# EAGLE design ISPBreakout (EAGLE 6.4)
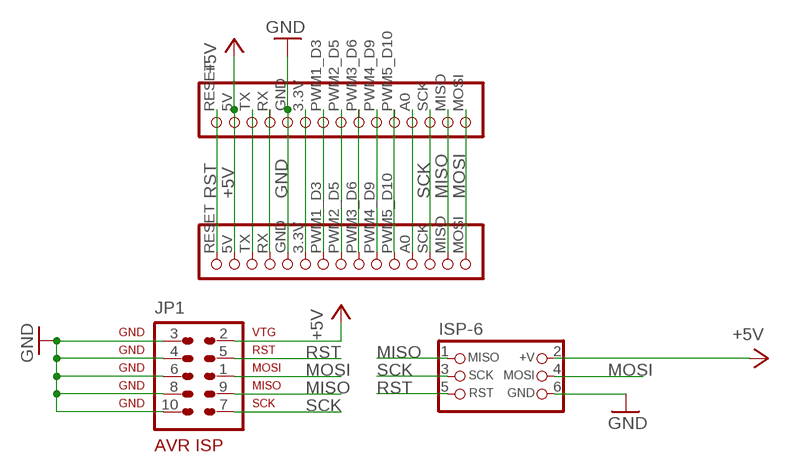
[diagram p0: schematic, sheet 1]

## Parts
ISP-6  ISP 6  CON_HEADER_PRG_AVR_ICSP-PTH  [HEADER_PRG_2X03]
JP1  ISP-10  AVR-ISP-10  [AVR-ISP-10]
U$1  RF1_HEADER_LEFT  [RF1_LEFTHEADER_ONLY]
U$2  RF1_HEADER_LEFT  [RF1_LEFTHEADER_ONLY]

## Nets
+5V: ISP-6.2(+V) JP1.2 U$1.5V U$2.5V
GND: ISP-6.6(GND) JP1.3 JP1.4 JP1.6 JP1.8 JP1.10 U$1.GND U$2.GND
MISO: ISP-6.1(MISO) JP1.9 U$1.MISO U$2.MISO
MOSI: ISP-6.4(MOSI) JP1.1 U$1.MOSI U$2.MOSI
N$1: U$1.TX U$2.TX
N$2: U$1.RX U$2.RX
N$3: U$1.3.3V U$2.3.3V
N$4: U$1.PWM1_D3(PWM1) U$2.PWM1_D3(PWM1)
N$5: U$1.PWM2_D5(PWM2) U$2.PWM2_D5(PWM2)
N$6: U$1.PWM3_D6(PWM3) U$2.PWM3_D6(PWM3)
N$7: U$1.PWM4_D9(PWM4) U$2.PWM4_D9(PWM4)
N$8: U$1.PWM5_D10(PWM5) U$2.PWM5_D10(PWM5)
N$9: U$1.A0(PC0) U$2.A0(PC0)
RST: ISP-6.5(RST) JP1.5 U$1.RESET U$2.RESET
SCK: ISP-6.3(SCK) JP1.7 U$1.SCK U$2.SCK

## Library data of the parts
ISP-6 = kombytax:CON_HEADER_PRG_AVR_ICSP: 2x3 AVR ICSP programming header
JP1 = avr-7:AVR-ISP-10: AVR ISP-10 Serial Programming Header
U$1 U$2 = komby1:RF1_HEADER_LEFT

## Board
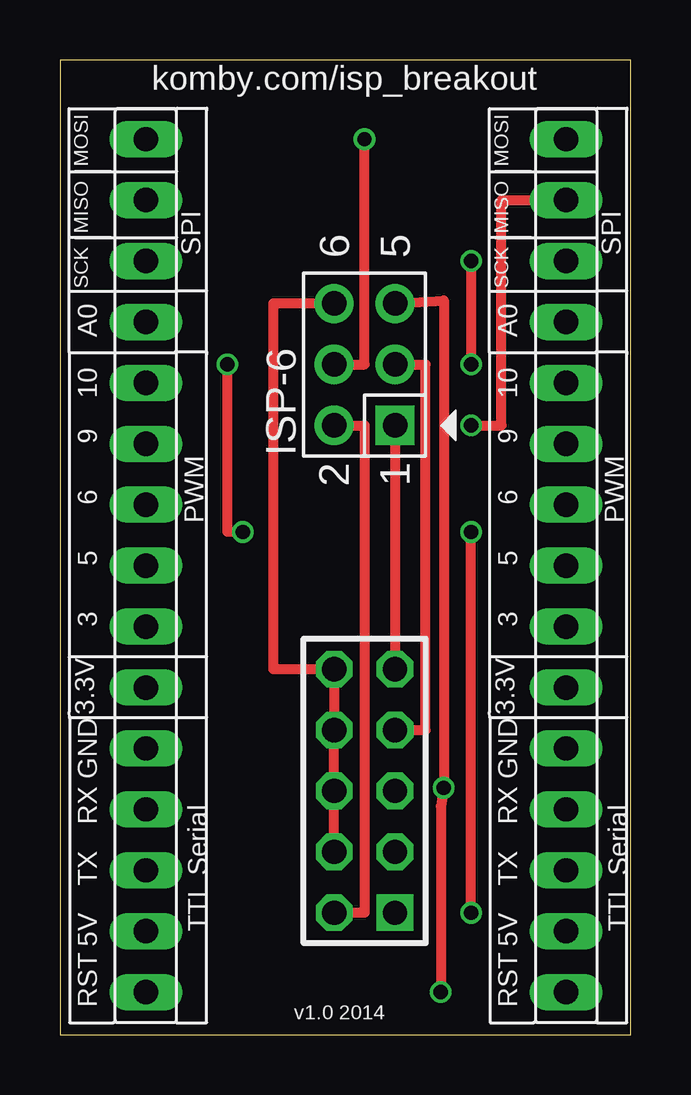
[diagram p1: board, top side]
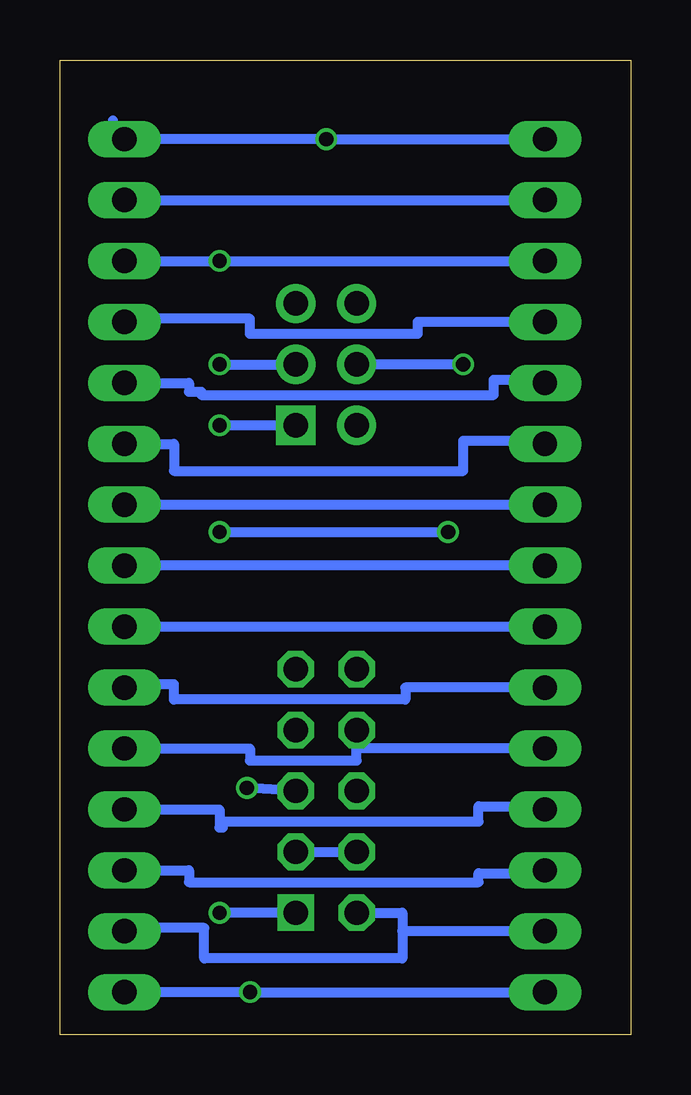
[diagram p2: board, bottom side, seen from below]

Size 23.8 x 40.63 mm. Coordinates in mm from the lower left corner, seen from the top.
Outline: 0,0 23.8,0 23.8,40.63 0,40.63 0,0
Copper layers (1*16): Top 0.035mm / dielectric 1.5mm / Bottom 0.035mm
Design rules "Fusion_eagle_rule_v1.1": minimum track width 6mil, minimum drill 12mil, track to track 6mil, track to pad 6mil, pad to pad 6mil, via to via 6mil, smd to smd 0mil, copper to edge 10mil, drill to drill 10mil, minimum pad ring 10mil, minimum via ring 6mil, stop-mask expansion 2mil, vias tented up to drill 100mil, thermal gap 10mil

### Footprints (pad centres in the part's own frame; a part is rotated, then mirrored left to right if it is on the bottom)
HEADER_PRG_2X03 = drill 1.02 pad 1.632 square: 1 -2.54,-1.27 | drill 1.02 pad 1.632: 2 -2.54,1.27; 3 0,-1.27; 4 0,1.27; 5 2.54,-1.27; 6 2.54,1.27
AVR-ISP-10 = drill 1.016 square: 1 -5.08,-1.27 | drill 1.016 octagon: 2 -5.08,1.27; 3 -2.54,-1.27; 4 -2.54,1.27; 5 0,-1.27; 6 0,1.27; 7 2.54,-1.27; 8 2.54,1.27; 9 5.08,-1.27; 10 5.08,1.27
RF1_LEFTHEADER_ONLY = drill 1.016 long: 3.3V 1.42,-5.215; 5V 1.42,-15.375; A0 1.42,10.025; GND 1.42,-7.755; MISO 1.42,15.105; MOSI 1.42,17.645; PWM1_D3 1.42,-2.675; PWM2_D5 1.42,-0.135; PWM3_D6 1.42,2.405; PWM4_D9 1.42,4.945; PWM5_D10 1.42,7.485; RESET 1.42,-17.915; RX 1.42,-10.295; SCK 1.42,12.565; TX 1.42,-12.835

### Placement (x,y rotation side)
ISP-6  12.7,27.94 90 top
JP1  12.7,10.16 90 top
U$1  19.68,19.68 0 top
U$2  2.16,19.68 0 top

### Tracks (layer width: path | path; a pad name or v marks a point on that pad's centre or on a via)
+5V
  Top 0.406: ISP-6.2 12.7,25.4 12.7,5.08 JP1.2
  Bottom 0.406: U$2.5V 9.53,4.31 | 9.53,4.31 9.53,3.17 17.78,3.17 17.78,4.45 21.11,4.45 U$1.5V | JP1.2 9.53,5.08 9.53,4.31
GND
  Top 0.406: JP1.4 JP1.6 JP1.8 JP1.10 8.89,15.24 8.89,30.48 ISP-6.6
  Bottom 0.406: U$2.GND 11.43,11.93 | 11.43,11.93 JP1.8 | U$1.GND 15.88,11.93 15.88,11.43 11.43,11.43 11.43,11.93 | JP1.3 JP1.4
MISO  (via drill 0.6)
  Top 0.406: v17.14,25.4 18.41,25.4 18.41,34.79 U$1.MISO | U$1.MISO 21.59,34.79 21.59,34.92 21.11,34.92 U$1.MISO | ISP-6.1 JP1.9
  Bottom 0.406: U$1.MISO U$2.MISO | ISP-6.1 v17.14,25.4
MOSI  (via drill 0.6)
  Top 0.406: ISP-6.4 12.7,27.94 v12.7,37.33 | v17.14,5.08 v17.14,20.95 | v7.62,20.95 6.99,20.95 v6.99,27.94
  Bottom 0.406: U$1.MOSI v12.7,37.33 U$2.MOSI | U$1.MOSI 21.11,36.83 21.59,36.83 21.59,37.33 | U$1.MOSI 21.59,37.33 | 21.59,37.33 21.59,38.1 | JP1.1 v17.14,5.08 | v17.14,20.95 v7.62,20.95 | v6.99,27.94 ISP-6.4
N$1
  Bottom 0.406: U$1.TX 18.41,6.85 18.41,6.35 6.35,6.35 6.35,6.73 3.33,6.73 U$2.TX
N$2
  Bottom 0.406: U$1.RX 17.14,9.39 17.14,8.64 17.02,8.64 17.02,8.89 6.35,8.89 6.35,9.53 4.45,9.53 4.45,8.89 3.33,8.89 U$2.RX
N$3
  Bottom 0.406: U$2.3.3V 9.4,14.47 9.4,13.97 19.05,13.97 19.05,14.61 21.11,14.61 U$1.3.3V
N$4
  Bottom 0.406: U$1.PWM1_D3 U$2.PWM1_D3
N$5
  Bottom 0.406: U$2.PWM2_D5 U$1.PWM2_D5
N$6
  Bottom 0.406: U$1.PWM3_D6 U$2.PWM3_D6
N$7
  Bottom 0.406: U$1.PWM4_D9 19.05,24.63 19.05,23.5 6.99,23.5 6.99,24.77 3.33,24.77 U$2.PWM4_D9
N$8
  Bottom 0.406: U$1.PWM5_D10 18.41,27.17 18.41,26.8 17.91,26.8 17.91,26.67 5.71,26.67 5.71,27.3 3.33,27.3 U$2.PWM5_D10
N$9
  Bottom 0.406: U$2.A0 8.89,29.71 8.89,29.21 15.88,29.21 15.88,29.84 21.11,29.84 U$1.A0
RST  (via drill 0.6)
  Top 0.406: v15.88,1.77 15.88,9.53 v16,10.29 16,30.61 ISP-6.5
  Bottom 0.406: U$2.RESET v15.88,1.77 U$1.RESET | JP1.5 v16,10.29
SCK  (via drill 0.6)
  Top 0.406: v17.14,32.26 v17.14,27.94 | JP1.7 15.24,12.7 15.24,27.94 ISP-6.3
  Bottom 0.406: U$2.SCK U$1.SCK v17.14,32.25 v17.14,32.26 | v17.14,27.94 ISP-6.3

### Text on the board
tNames: komby.com/isp_breakout | v1.0 2014